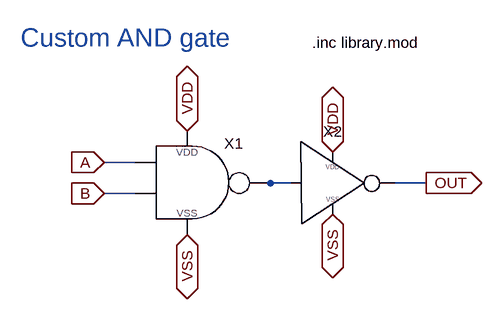
[diagram p0: schematic my_and.asc]
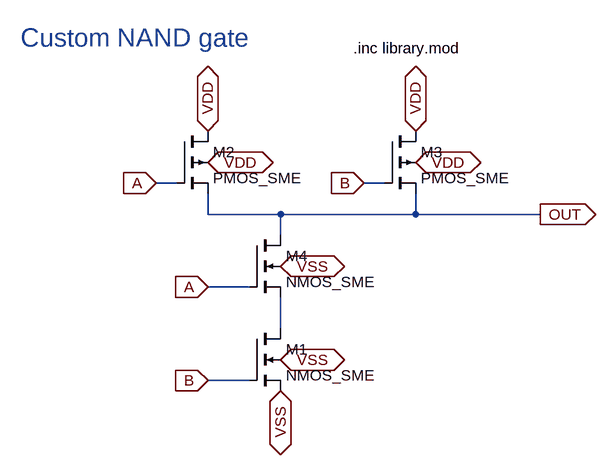
[diagram p1: sub-circuit my_nand.asc]
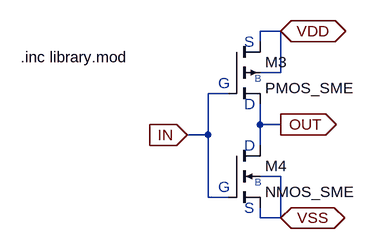
[diagram p2: sub-circuit my_inverter.asc]
my_and.asc, the LTspice schematic file:
Version 4.1
SHEET 1 1328 780
WIRE 96 272 48 272
WIRE 336 304 272 304
WIRE 544 304 496 304
WIRE 96 320 48 320
FLAG 176 224 VDD
IOPIN 176 224 BiDir
FLAG 176 384 VSS
IOPIN 176 384 BiDir
FLAG 48 272 A
IOPIN 48 272 In
FLAG 48 320 B
IOPIN 48 320 In
FLAG 400 352 VSS
IOPIN 400 352 BiDir
FLAG 400 256 VDD
IOPIN 400 256 BiDir
FLAG 544 304 OUT
IOPIN 544 304 Out
SYMBOL my_nand 176 304 R0
SYMATTR InstName X1
SYMBOL my_inverter 400 304 R0
SYMATTR InstName X2
TEXT -80 80 Left 4 ;Custom AND gate
TEXT 368 88 Left 2 !.inc library.mod

my_nand.asc, the sub-circuit schematic file:
Version 4.1
SHEET 1 880 716
WIRE 128 272 96 272
WIRE 448 272 416 272
WIRE 176 320 176 288
WIRE 288 320 176 320
WIRE 496 320 496 288
WIRE 496 320 288 320
WIRE 688 320 496 320
WIRE 288 352 288 320
WIRE 240 432 176 432
WIRE 288 496 288 448
WIRE 240 576 176 576
FLAG 96 272 A
IOPIN 96 272 In
FLAG 176 432 A
IOPIN 176 432 In
FLAG 416 272 B
IOPIN 416 272 In
FLAG 176 576 B
IOPIN 176 576 In
FLAG 176 192 VDD
IOPIN 176 192 BiDir
FLAG 176 240 VDD
IOPIN 176 240 BiDir
FLAG 496 192 VDD
IOPIN 496 192 BiDir
FLAG 496 240 VDD
IOPIN 496 240 BiDir
FLAG 288 592 VSS
IOPIN 288 592 BiDir
FLAG 288 544 VSS
IOPIN 288 544 BiDir
FLAG 288 400 VSS
IOPIN 288 400 BiDir
FLAG 688 320 OUT
IOPIN 688 320 Out
SYMBOL nmos4 240 496 R0
SYMATTR InstName M1
SYMATTR Value NMOS_SME
SYMATTR Value2 l=0.35u w=0.4u
SYMBOL pmos4 128 192 R0
SYMATTR InstName M2
SYMATTR Value PMOS_SME
SYMATTR Value2 l=0.35u w=0.4u
SYMBOL pmos4 448 192 R0
SYMATTR InstName M3
SYMATTR Value PMOS_SME
SYMATTR Value2 l=0.35u w=0.4u
SYMBOL nmos4 240 352 R0
SYMATTR InstName M4
SYMATTR Value NMOS_SME
SYMATTR Value2 l=0.35u w=0.4u
TEXT -112 48 Left 4 ;Custom NAND gate
TEXT 400 64 Left 2 !.inc library.mod

my_inverter.asc, the sub-circuit schematic file:
Version 4.1
SHEET 1 880 680
WIRE 608 -32 576 -32
WIRE 576 -16 576 -32
WIRE 608 32 608 -32
WIRE 608 32 576 32
WIRE 528 64 496 64
WIRE 576 112 576 80
WIRE 608 112 576 112
WIRE 496 128 496 64
WIRE 496 128 464 128
WIRE 576 144 576 112
WIRE 608 192 576 192
WIRE 496 224 496 128
WIRE 528 224 496 224
WIRE 576 256 576 240
WIRE 608 256 608 192
WIRE 608 256 576 256
FLAG 608 -32 VDD
IOPIN 608 -32 BiDir
FLAG 608 256 VSS
IOPIN 608 256 BiDir
FLAG 608 112 OUT
IOPIN 608 112 Out
FLAG 464 128 IN
IOPIN 464 128 In
SYMBOL pmos4 528 -16 R0
SYMATTR InstName M3
SYMATTR Value PMOS_SME
SYMATTR Value2 l=0.35u w=0.4u
SYMBOL nmos4 528 144 R0
SYMATTR InstName M4
SYMATTR Value NMOS_SME
SYMATTR Value2 l=0.35u w=0.4u
TEXT 552 -16 Left 2 ;S
TEXT 552 240 Left 2 ;S
TEXT 552 80 Left 2 ;D
TEXT 552 144 Left 2 ;D
TEXT 512 48 Left 2 ;G
TEXT 512 208 Left 2 ;G
TEXT 568 40 Left 1 ;B
TEXT 568 200 Left 1 ;B
TEXT 208 8 Left 2 !.inc library.mod

The netlist it stands for:
* my_and.asc
X§X1 A B N001 VDD VSS my_nand
X§X2 N001 OUT VDD VSS my_inverter

* block symbol definitions
.subckt my_nand A B OUT VDD VSS
M1 N001 B VSS VSS NMOS_SME l=0.35u w=0.4u
M2 VDD A OUT VDD PMOS_SME l=0.35u w=0.4u
M3 VDD B OUT VDD PMOS_SME l=0.35u w=0.4u
M4 OUT A N001 VSS NMOS_SME l=0.35u w=0.4u
* Custom NAND gate
.inc library.mod
.ends my_nand

.subckt my_inverter IN OUT VDD VSS
M3 VDD IN OUT VDD PMOS_SME l=0.35u w=0.4u
M4 OUT IN VSS VSS NMOS_SME l=0.35u w=0.4u
* S
* S
* D
* D
* G
* G
* B
* B
.inc library.mod
.ends my_inverter

.model NMOS NMOS
.model PMOS PMOS
.lib standard.mos
* Custom AND gate
.inc library.mod
.backanno
.end